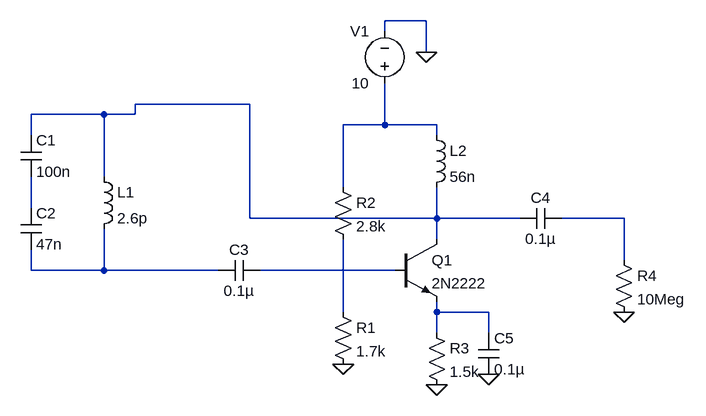
[diagram p0: schematic Draft13.asc]
Draft13.asc, the LTspice schematic file:
Version 4
SHEET 1 884 680
WIRE 480 -128 416 -128
WIRE 416 -112 416 -128
WIRE 480 -80 480 -128
WIRE 208 0 32 0
WIRE -16 16 -128 16
WIRE 32 16 32 0
WIRE 32 16 -16 16
WIRE 416 32 416 -32
WIRE 416 32 352 32
WIRE 496 32 416 32
WIRE -128 48 -128 16
WIRE 496 48 496 32
WIRE -16 112 -16 16
WIRE 352 128 352 32
WIRE -128 160 -128 112
WIRE 208 176 208 0
WIRE 496 176 496 128
WIRE 496 176 208 176
WIRE 624 176 496 176
WIRE 784 176 688 176
WIRE 496 208 496 176
WIRE 784 240 784 176
WIRE -128 256 -128 224
WIRE -16 256 -16 192
WIRE -16 256 -128 256
WIRE 160 256 -16 256
WIRE 432 256 224 256
WIRE 352 320 352 208
WIRE 496 320 496 304
WIRE 576 320 496 320
WIRE 496 352 496 320
WIRE 576 352 576 320
FLAG 496 432 0
FLAG 576 416 0
FLAG 480 -80 0
FLAG 352 400 0
FLAG 784 320 0
SYMBOL ind -32 96 R0
SYMATTR InstName L1
SYMATTR Value 2.6p
SYMBOL cap -144 48 R0
SYMATTR InstName C1
SYMATTR Value 100n
SYMBOL cap -144 160 R0
SYMATTR InstName C2
SYMATTR Value 47n
SYMBOL res 336 304 R0
SYMATTR InstName R1
SYMATTR Value 1.7k
SYMBOL res 336 112 R0
SYMATTR InstName R2
SYMATTR Value 2.8k
SYMBOL cap 224 240 R90
WINDOW 0 0 32 VBottom 2
WINDOW 3 32 32 VTop 2
SYMATTR InstName C3
SYMATTR Value 0.1µ
SYMBOL npn 432 208 R0
SYMATTR InstName Q1
SYMATTR Value 2N2222
SYMBOL ind 480 32 R0
SYMATTR InstName L2
SYMATTR Value 56n
SYMBOL res 480 336 R0
SYMATTR InstName R3
SYMATTR Value 1.5k
SYMBOL cap 688 160 R90
WINDOW 0 0 32 VBottom 2
WINDOW 3 32 32 VTop 2
SYMATTR InstName C4
SYMATTR Value 0.1µ
SYMBOL res 768 224 R0
SYMATTR InstName R4
SYMATTR Value 10Meg
SYMBOL voltage 416 -16 R180
WINDOW 0 24 96 Left 2
WINDOW 3 24 16 Left 2
WINDOW 123 0 0 Left 0
WINDOW 39 0 0 Left 0
SYMATTR InstName V1
SYMATTR Value 10
SYMBOL cap 560 352 R0
SYMATTR InstName C5
SYMATTR Value 0.1µ

The netlist it stands for:
* Draft13.asc
L1 N001 N005 2.6p
C1 N001 N003 100n
C2 N003 N005 47n
R1 N007 0 1.7k
R2 N002 N007 2.8k
C3 N006 N005 0.1µ
Q1 N001 N006 N008 0 2N2222
L2 N002 N001 56n
R3 N008 0 1.5k
C4 N004 N001 0.1µ
R4 N004 0 10Meg
V1 N002 0 10
C5 N008 0 0.1µ
.model NPN NPN
.model PNP PNP
.lib standard.bjt
.backanno
.end